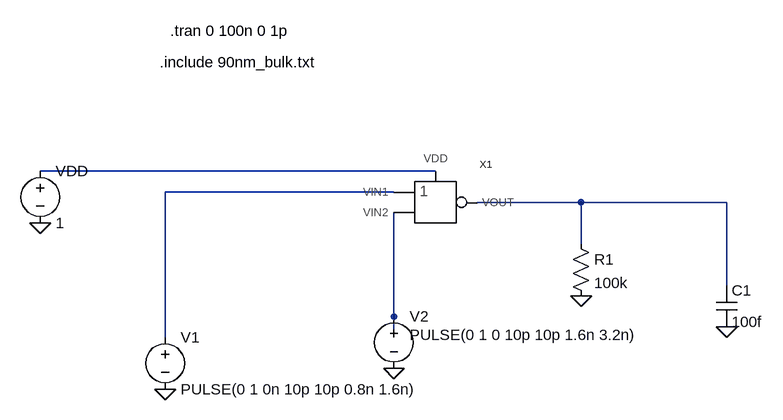
[diagram p0: schematic Draft5.asc]
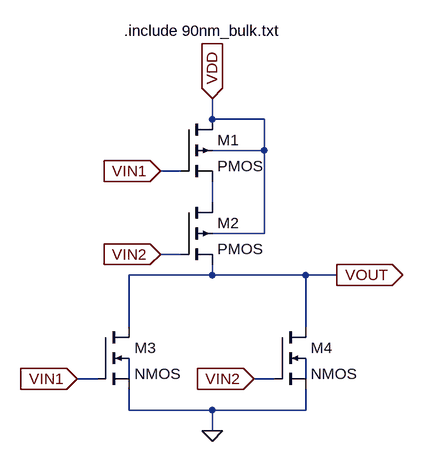
[diagram p1: sub-circuit nor.asc]
Draft5.asc, the LTspice schematic file:
Version 4
SHEET 1 880 680
WIRE -208 -96 -816 -96
WIRE -272 -64 -624 -64
WIRE 16 -48 -144 -48
WIRE 240 -48 16 -48
WIRE 16 16 16 -48
WIRE 240 80 240 -48
WIRE -272 128 -272 -32
WIRE -624 160 -624 -64
WIRE -272 160 -272 128
FLAG 16 96 0
FLAG 240 144 0
FLAG -624 240 0
FLAG -816 -16 0
FLAG -272 208 0
SYMBOL voltage -624 144 R0
WINDOW 123 0 0 Left 0
WINDOW 39 0 0 Left 0
SYMATTR InstName V1
SYMATTR Value PULSE(0 1 0n 10p 10p 0.8n 1.6n)
SYMBOL res 0 0 R0
SYMATTR InstName R1
SYMATTR Value 100k
SYMBOL cap 224 80 R0
SYMATTR InstName C1
SYMATTR Value 100f
SYMBOL voltage -816 -112 R0
WINDOW 123 0 0 Left 0
WINDOW 39 0 0 Left 0
SYMATTR InstName VDD
SYMATTR Value 1
SYMBOL voltage -272 112 R0
WINDOW 3 24 44 Left 2
WINDOW 123 0 0 Left 0
WINDOW 39 0 0 Left 0
SYMATTR Value PULSE(0 1 0 10p 10p 1.6n 3.2n)
SYMATTR InstName V2
SYMBOL NOR -208 -48 R0
SYMATTR InstName X1
TEXT -632 -264 Left 2 !.include 90nm_bulk.txt
TEXT -616 -312 Left 2 !.tran 0 100n 0 1p

nor.asc, the sub-circuit schematic file:
Version 4
SHEET 1 880 680
WIRE 208 96 208 64
WIRE 288 96 208 96
WIRE 288 144 288 96
WIRE 288 144 208 144
WIRE 160 176 128 176
WIRE 208 224 208 192
WIRE 288 272 288 144
WIRE 288 272 208 272
WIRE 160 304 128 304
WIRE 208 336 208 320
WIRE 208 336 80 336
WIRE 352 336 208 336
WIRE 400 336 352 336
WIRE 80 416 80 336
WIRE 352 416 352 336
WIRE 32 496 0 496
WIRE 80 496 80 464
WIRE 304 496 272 496
WIRE 352 496 352 464
WIRE 80 544 80 512
WIRE 208 544 80 544
WIRE 352 544 352 512
WIRE 352 544 208 544
WIRE 208 576 208 544
FLAG 128 176 VIN1
IOPIN 128 176 In
FLAG 0 496 VIN1
IOPIN 0 496 In
FLAG 128 304 VIN2
IOPIN 128 304 In
FLAG 272 496 VIN2
IOPIN 272 496 In
FLAG 208 64 VDD
IOPIN 208 64 In
FLAG 400 336 VOUT
IOPIN 400 336 Out
FLAG 208 576 0
SYMBOL pmos4 160 96 R0
SYMATTR InstName M1
SYMATTR Value2 l=90n w=400n
SYMBOL pmos4 160 224 R0
SYMATTR InstName M2
SYMATTR Value2 l=90n w=400n
SYMBOL nmos4 32 416 R0
SYMATTR InstName M3
SYMATTR Value2 l=90n w=200n
SYMBOL nmos4 304 416 R0
SYMATTR InstName M4
SYMATTR Value2 l=90n w=200n
TEXT 72 -40 Left 2 !.include 90nm_bulk.txt

The netlist it stands for:
* Draft5.asc
V1 N002 0 PULSE(0 1 0n 10p 10p 0.8n 1.6n)
R1 N003 0 100k
C1 N003 0 100f
VDD N001 0 1
V2 N004 0 PULSE(0 1 0 10p 10p 1.6n 3.2n)
XX1 N002 N003 N004 N001 nor

* block symbol definitions
.subckt nor VIN1 VOUT VIN2 VDD
M1 VDD VIN1 N001 VDD PMOS l=90n w=400n
M2 N001 VIN2 VOUT VDD PMOS l=90n w=400n
M3 VOUT VIN1 0 N002 NMOS l=90n w=200n
M4 VOUT VIN2 0 N003 NMOS l=90n w=200n
.include 90nm_bulk.txt
.ends nor

.model NMOS NMOS
.model PMOS PMOS
.lib standard.mos
.include 90nm_bulk.txt
.tran 0 100n 0 1p
.backanno
.end